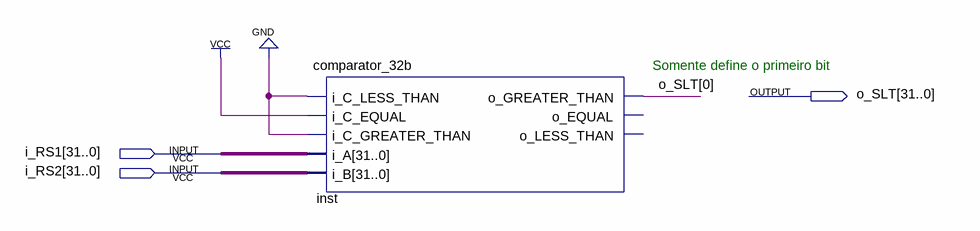
[diagram p0: schematic sheet]
// Quartus schematic set_if_less_than.bdf as structural Verilog: 1 symbols, 3 pins
module set_if_less_than (
  input  [31:0] i_RS1,
  input  [31:0] i_RS2,
  output [31:0] o_SLT
);

  comparator_32b inst (
    .i_C_LESS_THAN(1'b0), .i_C_EQUAL(1'b1), .i_C_GREATER_THAN(1'b0), .i_A(i_RS1), .i_B(i_RS2),
    .o_GREATER_THAN(o_SLT[0]));  // open: o_EQUAL, o_LESS_THAN

  // Notes on the sheet:
  //   Somente define o primeiro bit
endmodule
